# EAGLE design attiny45-microcontrol-v4.2-small-bts409l (EAGLE 6.5.0)
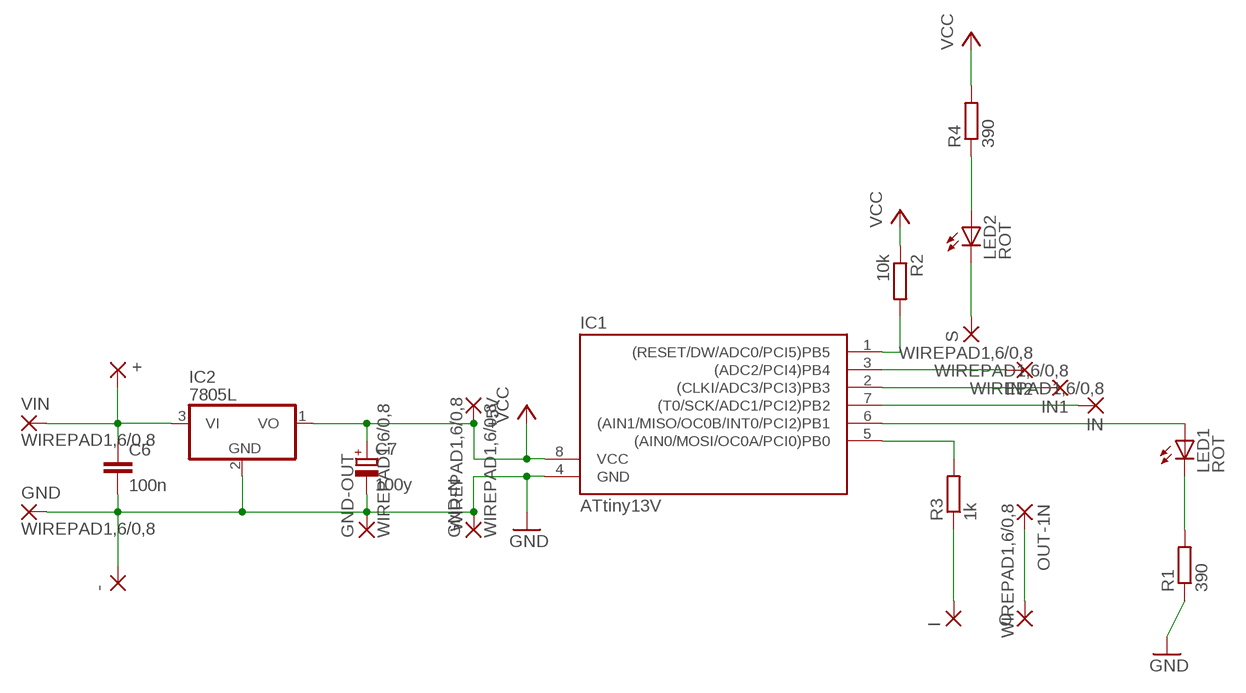
[diagram p0: schematic, sheet 1]

## Parts
+  SMD2  [SMD1,27-2,54]
+5V  WIREPAD1,6/0,8  [1,6/0,8]
-  SMD2  [SMD1,27-2,54]
C6  100n  C-EU050-035X075  [C050-035X075]
C7  100y  CPOL-EUE2.5-5  [E2,5-5]
GND  WIREPAD1,6/0,8  [1,6/0,8]
GND-N  WIREPAD1,6/0,8  [1,6/0,8]
GND-OUT  WIREPAD1,6/0,8  [1,6/0,8]
I  SMD2  [SMD1,27-2,54]
IC1  ATtiny13V  ATTINY13-20P  [DIL08]
IC2  7805L  [TO92]
IN  WIREPAD1,6/0,8  [1,6/0,8]
IN1  WIREPAD1,6/0,8  [1,6/0,8]
IN2  WIREPAD1,6/0,8  [1,6/0,8]
LED1  ROT  LED3MM  [LED3MM]
LED2  ROT  LED3MM  [LED3MM]
O  SMD2  [SMD1,27-2,54]
OUT-1N  WIREPAD1,6/0,8  [1,6/0,8]
R1  390  R-EU_0204/5  [0204/5]
R2  10k  R-EU_R1206  [R1206]
R3  1k  R-EU_0207/7  [0207/7]
R4  390  R-EU_0204/5  [0204/5]
S  SMD2  [SMD1,27-2,54]
VIN  WIREPAD1,6/0,8  [1,6/0,8]

## Nets
GND: -.1(P) C6.2 C7.- GND-N.1(P) GND-OUT.1(P) GND.1(P) IC1.4(GND) IC2.2(GND) R1.1
N$1: O.1(P) OUT-1N.1(P)
N$2: IC1.2((CLKI/ADC3/PCI3)PB3) IN1.1(P)
N$3: IC1.1((RESET/DW/ADC0/PCI5)PB5) R2.2
N$4: IC1.7((T0/SCK/ADC1/PCI2)PB2) IN.1(P)
N$5: IC1.6((AIN1/MISO/OC0B/INT0/PCI2)PB1) LED1.A
N$7: LED1.K(C) R1.2
N$8: IC1.3((ADC2/PCI4)PB4) IN2.1(P)
N$9: LED2.A R4.1
N$10: IC1.5((AIN0/MOSI/OC0A/PCI0)PB0) R3.2
N$11: I.1(P) R3.1
N$12: LED2.K(C) S.1(P)
N$14: +.1(P) C6.1 IC2.3(VI) VIN.1(P)
VCC: +5V.1(P) C7.+ IC1.8(VCC) IC2.1(VO) R2.1 R4.2

## Library data of the parts
+ - I O S = wirepad:SMD2: SMD PAD
+5V GND GND-N GND-OUT IN IN1 IN2 OUT-1N VIN = wirepad:WIREPAD: Wire PAD connect wire on PCB
C6 = rcl:C-EU: CAPACITOR, European symbol
C7 = rcl:CPOL-EU: POLARIZED CAPACITOR, European symbol
IC1 = avr:ATTINY13: MICROCONTROLLER 1 Kbytes FLASH 64 bytes EEPROM 64 bytes RAM 4-channel 10 bit ADC
IC2 = linear:78*: Positive VOLTAGE REGULATOR Source: http://cache.national.com/ds/LM/LM78L05.pdf http://www.fairchildsemi.com/ds/LM/LM7805.pdf
LED1 LED2 = led:LED: LED OSRAM: - CHIPLED LG R971, LG N971, LY N971, LG Q971, LY Q971, LO R971, LY R971 LH N974, LH R974 LS Q976, LO Q976, LY Q976 LO Q996 - Hyper CHIPLED LW Q18S LB Q993, LB Q99A, LB R99A - SideLED LS A670, LO A670, LY A670, LG A670, LP A670 LB A673, LV A673, LT A673, LW A673 LH A674 LY A675 LS A676, LA A676, LO A676, LY A676, LW A676 LS A679, LY A679, LG A679 - Hyper Micro SIDELED® LS Y876, LA Y876, LO Y876, LY Y876 LT Y87S - SmartLED LW L88C, LW L88S LB L89C, LB L89S, LG L890 LS L89K, LO L89K, LY L89K LS L896, LA L896, LO L896, LY L896 - TOPLED LS T670, LO T670, LY T670, LG T670, LP T670 LSG T670, LSP T670, LSY T670, LOP T670, LYG T670 LG T671, LOG T671, LSG T671 LB T673, LV T673, LT T673, LW T673 LH T674 LS T676, LA T676, LO T676, LY T676, LB T676, LH T676, LSB T676, LW T676 LB T67C, LV T67C, LT T67C, LS T67K, LO T67K, LY T67K, LW E67C LS E67B, LA E67B, LO E67B, LY E67B, LB E67C, LV E67C, LT E67C LW T67C LS T679, LY T679, LG T679 LS T770, LO T770, LY T770, LG T770, LP T770 LB T773, LV T773, LT T773, LW T773 LH T774 LS E675, LA E675, LY E675, LS T675 LS T776, LA T776, LO T776, LY T776, LB T776 LHGB T686 LT T68C, LB T68C - Hyper Mini TOPLED® LB M676 - Mini TOPLED Santana® LG M470 LS M47K, LO M47K, LY M47K Source: http://www.osram.convergy.de LUXEON: - LUMILED® LXK2-PW12-R00, LXK2-PW12-S00, LXK2-PW14-U00, LXK2-PW14-V00 LXK2-PM12-R00, LXK2-PM12-S00, LXK2-PM14-U00 LXK2-PE12-Q00, LXK2-PE12-R00, LXK2-PE12-S00, LXK2-PE14-T00, LXK2-PE14-U00 LXK2-PB12-K00, LXK2-PB12-L00, LXK2-PB12-M00, LXK2-PB14-N00, LXK2-PB14-P00, LXK2-PB14-Q00 LXK2-PR12-L00, LXK2-PR12-M00, LXK2-PR14-Q00, LXK2-PR14-R00 LXK2-PD12-Q00, LXK2-PD12-R00, LXK2-PD12-S00 LXK2-PH12-R00, LXK2-PH12-S00 LXK2-PL12-P00, LXK2-PL12-Q00, LXK2-PL12-R00 Source: www.luxeon.com KINGBRIGHT: KA-3528ASYC Source: www.kingbright.com
R1-R4 = rcl:R-EU_: RESISTOR, European symbol

## Net classes
0 default: clearance 0.355 mm

## Board
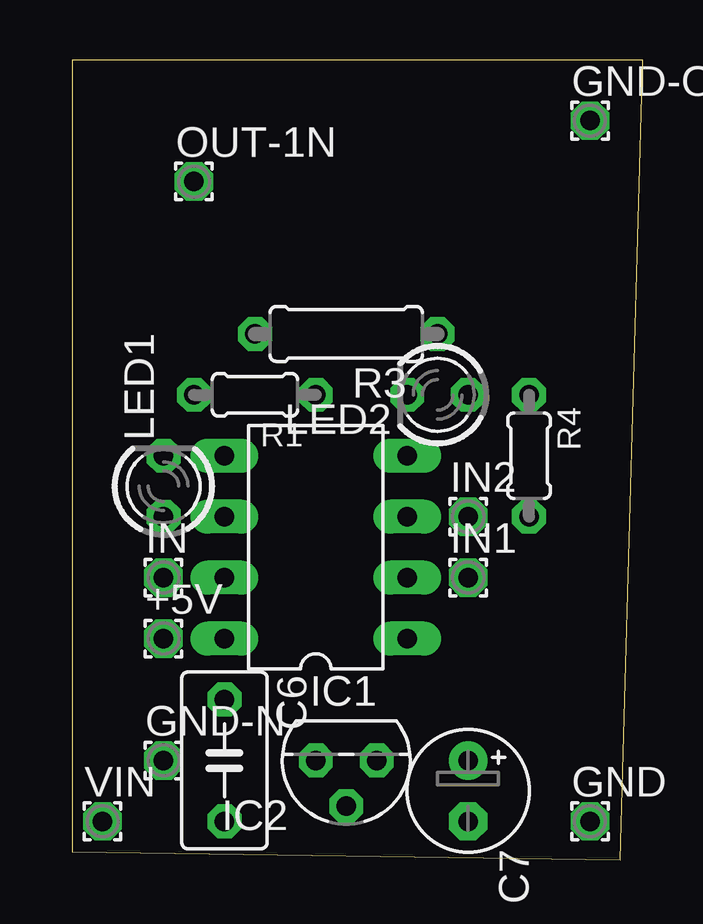
[diagram p1: board, top side]
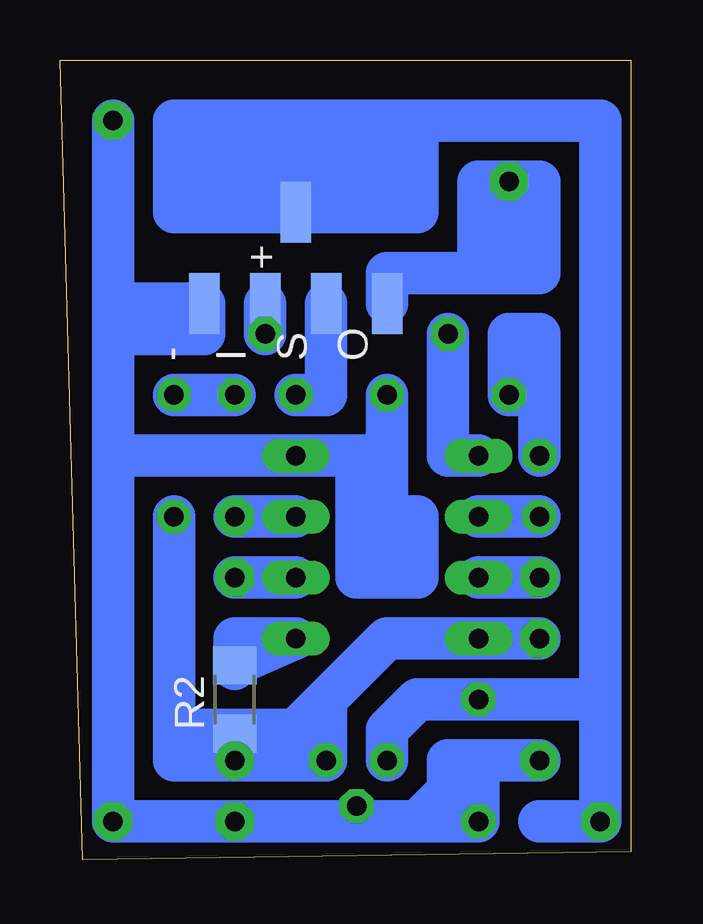
[diagram p2: board, bottom side, seen from below]

Size 23.8 x 33.34 mm. Coordinates in mm from the lower left corner, seen from the top.
Outline: 0,0.33 22.86,0 23.8,33.34 0,33.34 0,0.33
Copper layers (1*16): Top 0.035mm / dielectric 1.5mm / Bottom 0.035mm
Design rules "default *": minimum track width 10mil, minimum drill 24mil, track to track 8mil, track to pad 8mil, pad to pad 8mil, via to via 8mil, smd to smd 8mil, copper to edge 40mil, drill to drill 8mil, minimum pad ring 0.3mm, minimum via ring 10mil, stop-mask expansion 4mil, vias tented up to drill 0mil, thermal gap 10mil

### Footprints (pad centres in the part's own frame; a part is rotated, then mirrored left to right if it is on the bottom)
SMD1,27-2,54 = smd 1.27 x 2.54: 1 0,0
1,6/0,8 = drill 0.813 pad 1.6 octagon: 1 0,0
C050-035X075 = drill 0.813 octagon: 1 -2.54,0; 2 2.54,0
E2,5-5 = drill 0.813 pad 1.6: + -1.27,0 | drill 0.813 pad 1.6 octagon: - 1.27,0
DIL08 = drill 0.813 long: 1 -3.81,-3.81; 2 -1.27,-3.81; 3 1.27,-3.81; 4 3.81,-3.81; 5 3.81,3.81; 6 1.27,3.81; 7 -1.27,3.81; 8 -3.81,3.81
TO92 = drill 0.813 octagon: 1 -1.27,0; 2 0,1.905; 3 1.27,0
LED3MM = drill 0.813 octagon: A -1.27,0; K 1.27,0
0204/5 = drill 0.813 octagon: 1 -2.54,0; 2 2.54,0
R1206 = smd 1.6 x 1.803: 1 -1.422,0; 2 1.422,0
0207/7 = drill 0.813 octagon: 1 -3.81,0; 2 3.81,0

### Placement (x,y rotation side)
+  13.97,27 0 bottom
+5V  3.81,9.22 0 top
-  17.78,23.19 0 bottom
C6  6.35,4.14 270 top
C7  16.51,2.87 270 top
GND  21.59,1.6 0 top
GND-N  3.81,4.14 0 top
GND-OUT  21.59,30.81 0 top
I  15.24,23.19 0 bottom
IC1  10.16,13.03 90 top
IC2  11.43,4.14 180 top
IN  3.81,11.76 0 top
IN1  16.51,11.76 0 top
IN2  16.51,14.3 0 top
LED1  3.81,15.57 90 top
LED2  15.24,19.38 180 top
O  10.16,23.19 0 bottom
OUT-1N  5.08,28.27 0 top
R1  7.62,19.38 180 top
R2  16.51,6.68 90 bottom
R3  11.43,21.92 180 top
R4  19.05,16.84 270 top
S  12.7,23.19 0 bottom
VIN  1.27,1.6 0 top

### Tracks (layer width: path | path; a pad name or v marks a point on that pad's centre or on a via)
GND
  Bottom 1.422: 11.43,1.6 IC2.2
  Bottom 1.778: 7.62,1.6 C6.2 6.35,4.14 | 7.62,1.6 8.89,1.6 | 8.89,1.6 11.43,1.6 C7.- GND.1 21.59,16.84 | 8.89,1.6 7.62,2.87 | 7.62,2.87 7.62,4.14 6.35,4.14 | 21.59,16.84 21.59,21.92 | 21.59,16.84 IC1.4 11.43,16.84 | 11.43,16.84 10.16,16.84 | 10.16,16.84 R1.1 | 21.59,21.92 17.78,21.92 -.1 21.59,23.19 | GND-N.1 6.35,4.14 | 7.62,2.87 7.62,1.6 | 21.59,23.19 21.59,21.92 | 21.59,23.19 GND-OUT.1 | 11.43,16.84 11.43,11.76 10.16,11.76 | 10.16,11.76 8.89,11.76 8.89,14.3 10.16,14.3 | 10.16,14.3 10.16,16.84 | 10.16,14.3 10.16,11.76
N$1
  Bottom 1.778: O.1 10.16,24.46 6.35,24.46 | 6.35,24.46 6.35,28.27 OUT-1N.1 | 6.35,24.46 3.81,24.46 3.81,28.27 OUT-1N.1 | OUT-1N.1 5.08,25.73
N$2
  Bottom 1.778: IC1.2 IN1.1
N$3
  Bottom 1.778: R2.2 IC1.1 16.51,9.22 16.51,7.95
N$4
  Bottom 1.778: IC1.7 IN.1
N$5
  Bottom 1.778: IC1.6 LED1.A
N$7
  Bottom 1.778: LED1.K 3.81,19.38 | 3.81,19.38 R1.2 5.08,21.92 3.81,21.92 3.81,19.38
N$8
  Bottom 1.778: IC1.3 IN2.1
N$9
  Bottom 1.778: LED2.A R4.1
N$10
  Bottom 1.778: IC1.5 7.62,16.84 R3.2
N$11
  Bottom 1.778: R3.1 I.1
N$12
  Bottom 1.778: S.1 12.7,19.38 LED2.K
N$14
  Bottom 1.778: IC2.3 10.16,5.41 8.89,6.68 C6.1 1.27,6.68 | +.1 13.97,30.81 | 13.97,30.81 8.89,30.81 | 1.27,6.68 1.27,30.81 8.89,30.81 | 8.89,28.27 8.89,27 19.05,27 19.05,30.81 17.78,30.81 | 13.97,30.81 17.78,30.81 | 17.78,30.81 17.78,28.27 | 15.24,29.54 16.51,29.54 | 12.7,28.27 10.16,28.27 8.89,28.27 | 8.89,28.27 8.89,30.81 | 1.27,6.68 VIN.1 2.54,1.6 3.81,1.6
  Bottom 1.93: 17.78,28.27 15.24,28.27 15.24,29.54 10.16,29.54 10.16,28.27
VCC
  Bottom 1.422: C7.+ R2.1
  Bottom 1.778: 12.7,5.41 IC2.1 C7.+ 19.05,4.14 19.05,5.41 | 12.7,5.41 12.7,6.68 | 12.7,6.68 10.16,9.22 IC1.8 +5V.1 | 19.05,5.41 R4.2 | 13.97,5.41 12.7,5.41 | 13.97,5.41 17.78,5.41 | 13.97,5.41 12.7,6.68 | R2.1 17.78,5.41 | 17.78,5.41 19.05,5.41